# EAGLE design FIDO2AUTH_0021 (EAGLE 7.7.0)

## Sheet 1 of 4
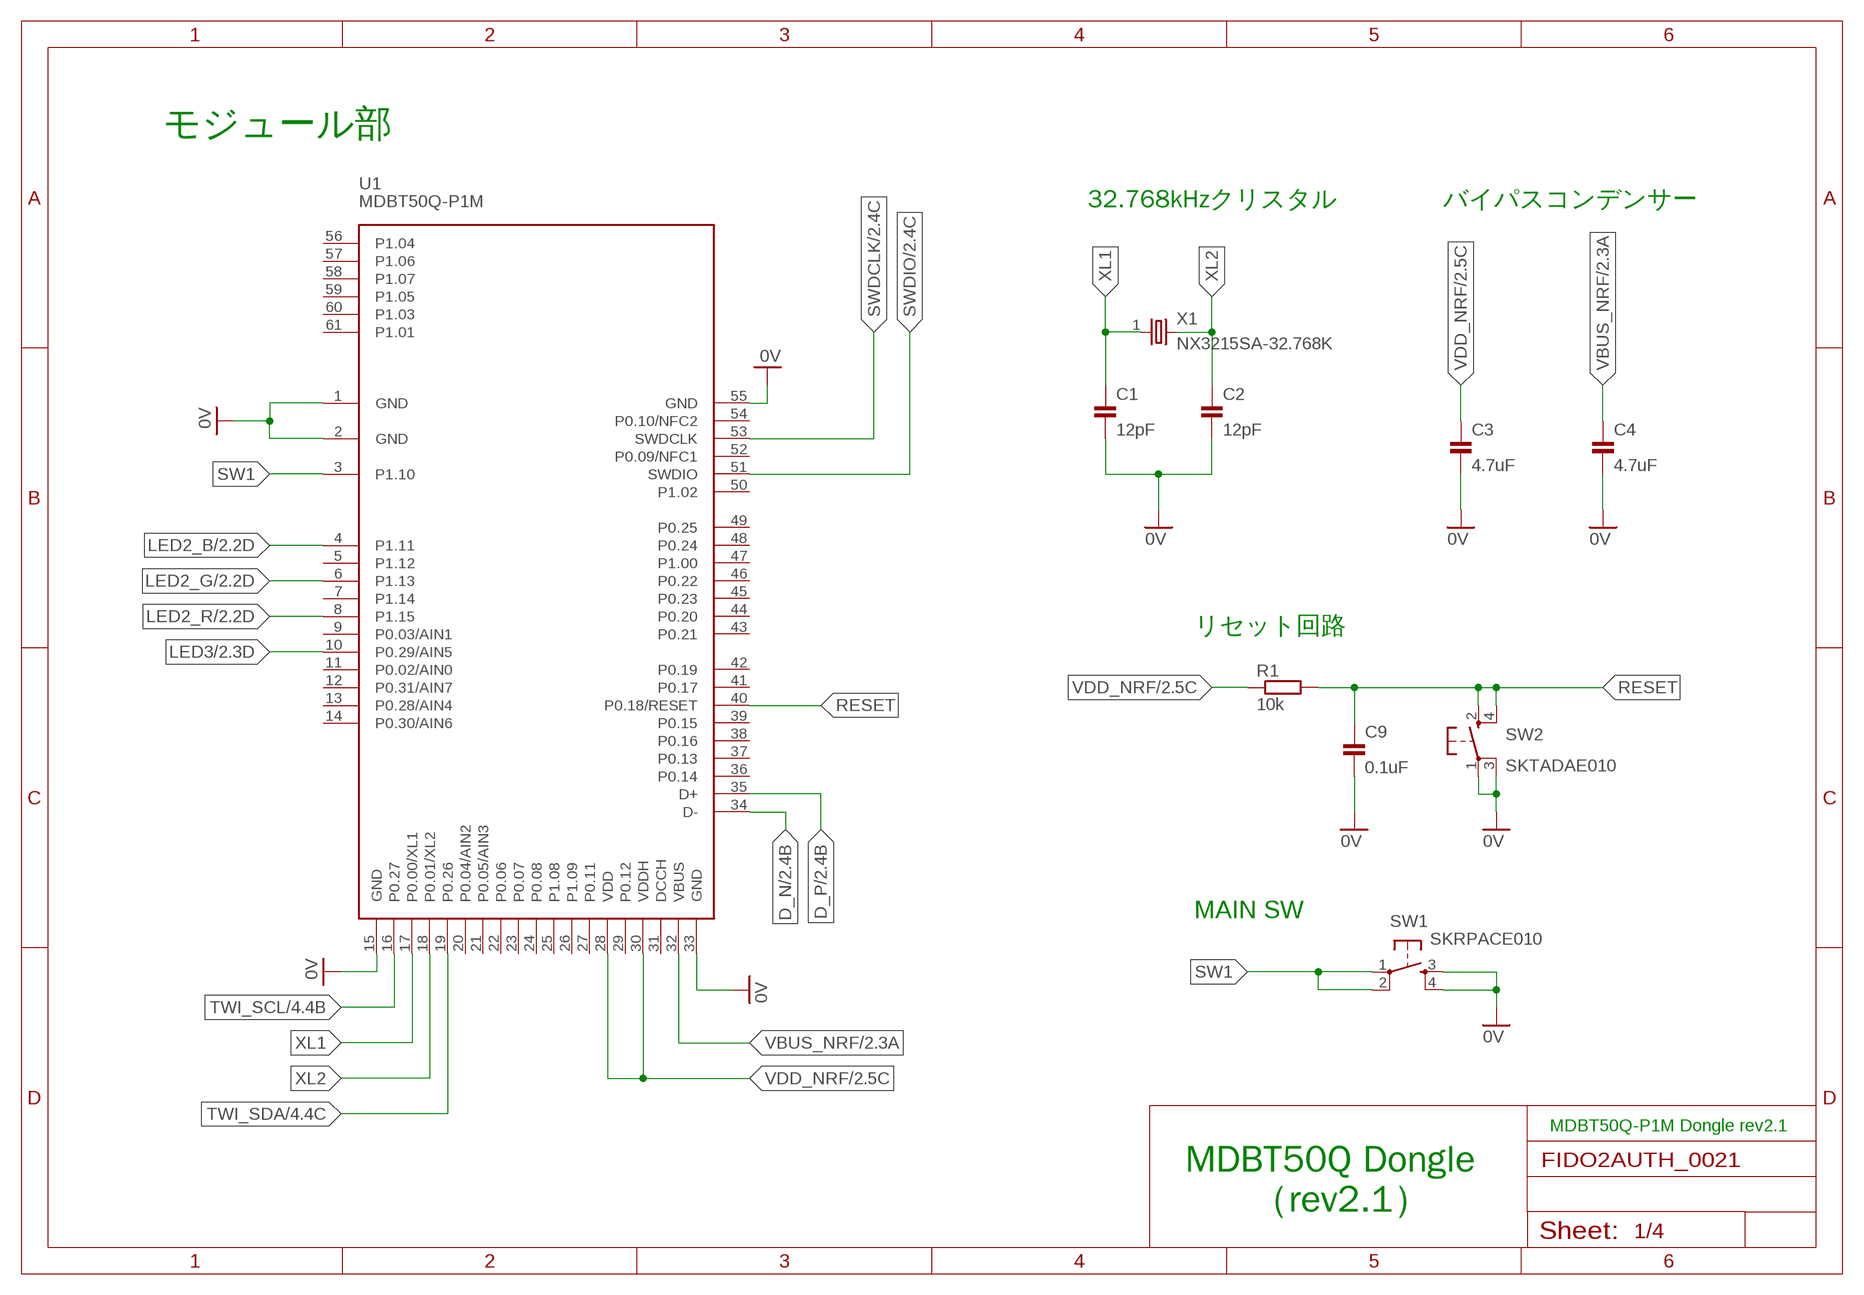
[diagram p0: schematic, sheet 1]

### Parts
C1  12pF  CAP_0603  [C0603K]
C2  12pF  CAP_0603  [C0603K]
C3  4.7uF  CAP_0603  [C0603K]
C4  4.7uF  CAP_0603  [C0603K]
C9  0.1uF  CAP_0402  [C0402K]
R1  10k  RESISTOR_0402  [R0402]
SW1  SKRPACE010  [SKRPACE010]
SW2  SKTADAE010  [SKTADAE010]
U1  MDBT50Q-P1M  [MDBT50Q-P1M]
X1  NX3215SA-32.768K  [NX3215]

### Nets
0V: C1.2 C2.2 C3.2 C4.2 C9.2 SW1.3(S) SW1.4(S1) SW2.1(P) SW2.3(P1) U1.1(GND) U1.2(GND) U1.15(GND) U1.33(GND) U1.55(GND) ; also sheet 2,3,4
D_N: U1.34(D-) ; also sheet 2
D_P: U1.35(D+) ; also sheet 2
LED2_B: U1.4(P1.11) ; also sheet 2
LED2_G: U1.6(P1.13) ; also sheet 2
LED2_R: U1.8(P1.15) ; also sheet 2
LED3: U1.10(P0.29/AIN5) ; also sheet 2
RESET: C9.1 R1.2 SW2.2(S) SW2.4(S1) U1.40(P0.18/RESET)
SW1: SW1.1(P) SW1.2(P1) U1.3(P1.10)
SWDCLK: U1.53(SWDCLK) ; also sheet 2
SWDIO: U1.51(SWDIO) ; also sheet 2
TWI_SCL: U1.16(P0.27) ; also sheet 4
TWI_SDA: U1.19(P0.26) ; also sheet 4
VBUS_NRF: C4.1 U1.32(VBUS) ; also sheet 2,3
VDD_NRF: C3.1 R1.1 U1.28(VDD) U1.30(VDDH) ; also sheet 2,3,4
XL1: C1.1 U1.17(P0.00/XL1) X1.1
XL2: C2.1 U1.18(P0.01/XL2) X1.2
Unconnected: U1.5(P1.12) U1.7(P1.14) U1.9(P0.03/AIN1) U1.11(P0.02/AIN0) U1.12(P0.31/AIN7) U1.13(P0.28/AIN4) U1.14(P0.30/AIN6) U1.20(P0.04/AIN2) U1.21(P0.05/AIN3) U1.22(P0.06) U1.23(P0.07) U1.24(P0.08) U1.25(P1.08) U1.26(P1.09) U1.27(P0.11) U1.29(P0.12) U1.31(DCCH) U1.36(P0.14) U1.37(P0.13) U1.38(P0.16) U1.39(P0.15) U1.41(P0.17) U1.42(P0.19) U1.43(P0.21) U1.44(P0.20) U1.45(P0.23) U1.46(P0.22) U1.47(P1.00) U1.48(P0.24) U1.49(P0.25) U1.50(P1.02) U1.52(P0.09/NFC1) U1.54(P0.10/NFC2) U1.56(P1.04) U1.57(P1.06) U1.58(P1.07) U1.59(P1.05) U1.60(P1.03) U1.61(P1.01)

### Notes on the sheet
- モジュール部
- 32.768kHzクリスタル | バイパスコンデンサー
- リセット回路
- MAIN SW
- MDBT50Q-P1M Dongle rev2.1
- MDBT50Q Dongle
        （rev2.1）

## Sheet 2 of 4
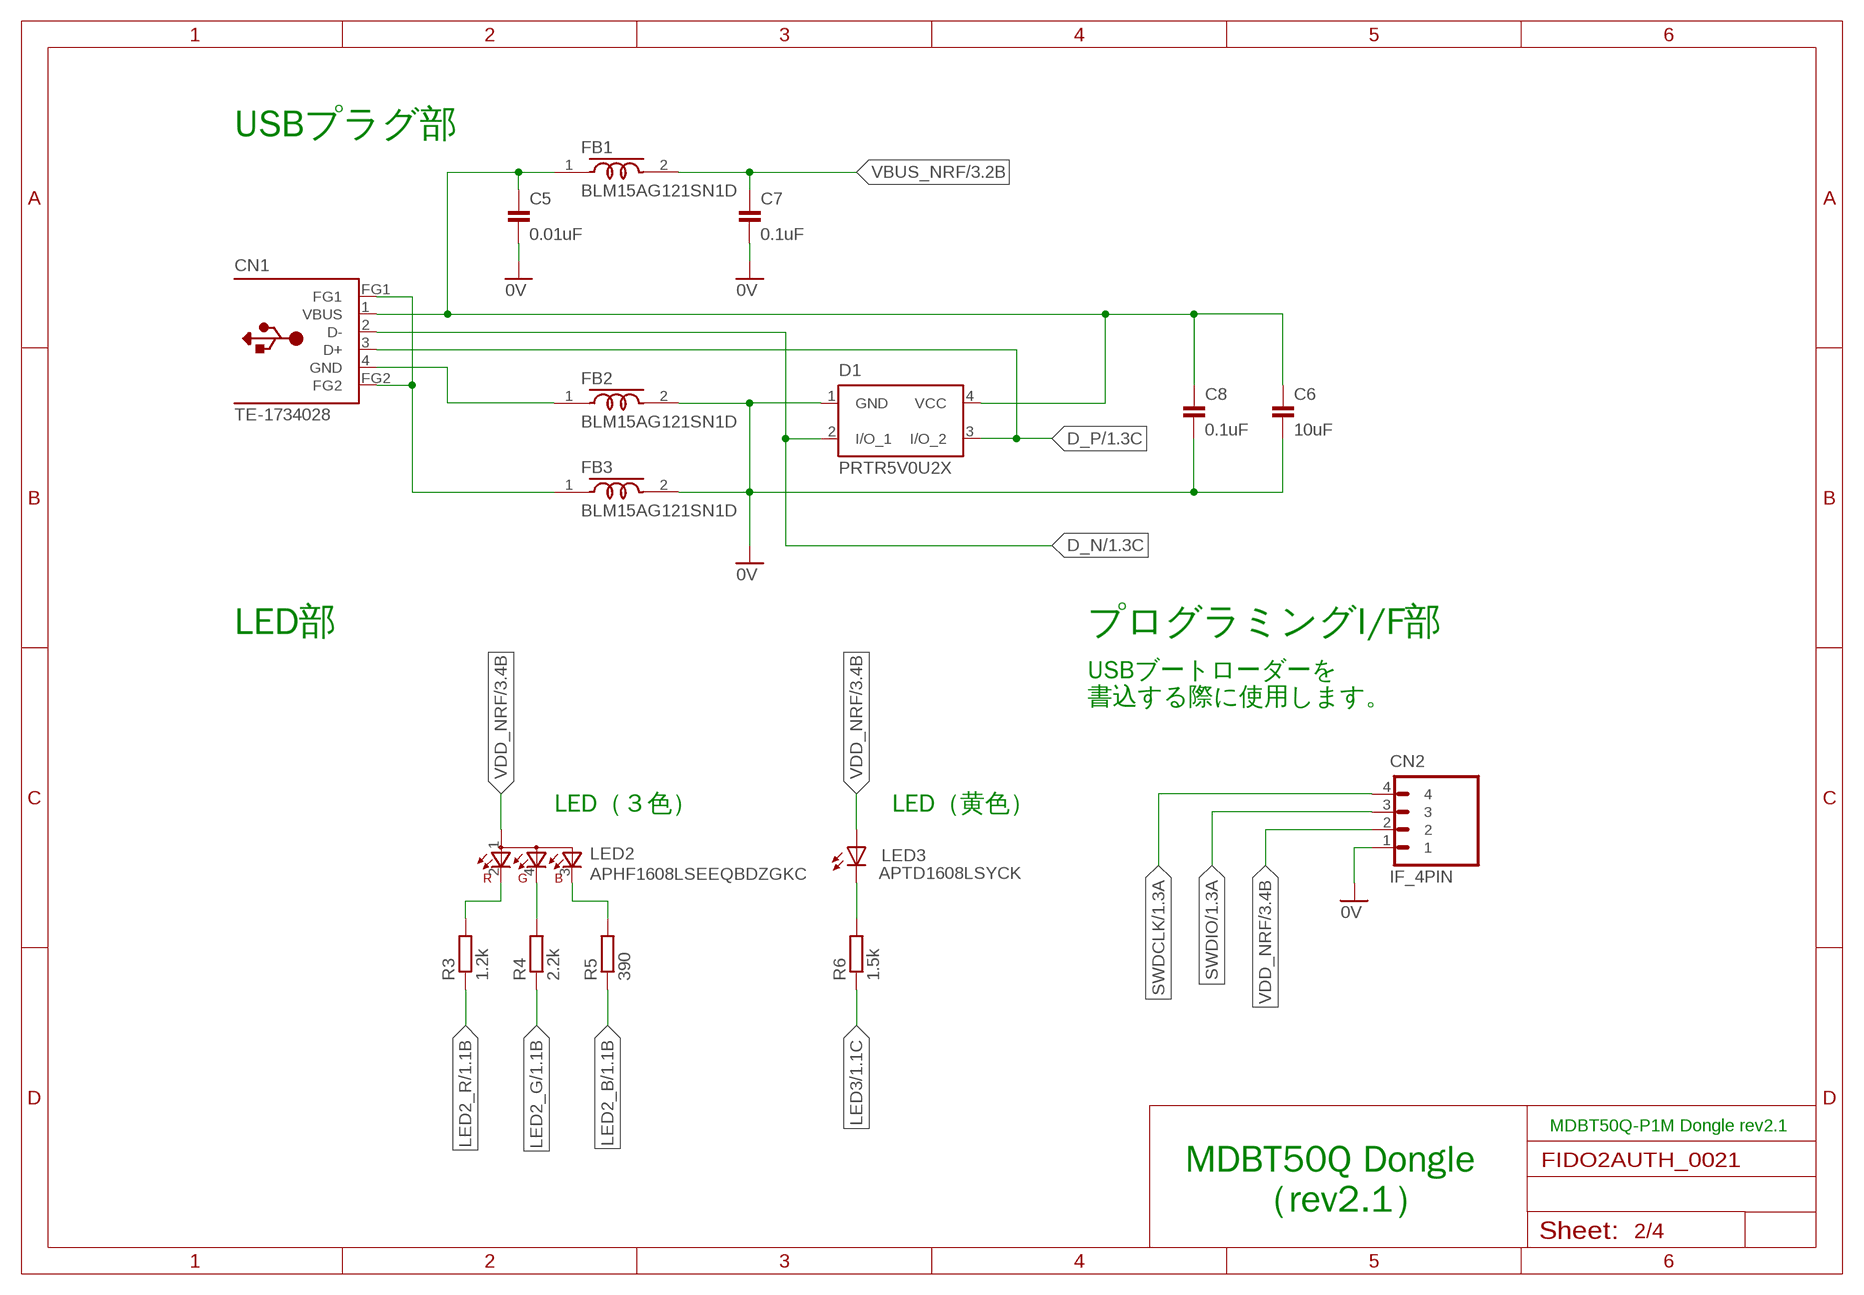
[diagram p1: schematic, sheet 2]

### Parts
C5  0.01uF  CAP_0402  [C0402K]
C6  10uF  CAP_0603  [C0603K]
C7  0.1uF  CAP_0402  [C0402K]
C8  0.1uF  CAP_0402  [C0402K]
CN1  TE-1734028  [TE-1734028]
CN2  IF_4PIN  [HEADER_4PIN]
D1  PRTR5V0U2X  [SOT143B]
FB1  BLM15AG121SN1D  [C0402K@1]
FB2  BLM15AG121SN1D  [C0402K@1]
FB3  BLM15AG121SN1D  [C0402K@1]
LED2  APHF1608LSEEQBDZGKC  [APHF1608LSEEQBDZGKC]
LED3  APTD1608LSYCK  [CHIPLED_0603]
R3  1.2k  RESISTOR_0402  [R0402]
R4  2.2k  RESISTOR_0402  [R0402]
R5  390  RESISTOR_0402  [R0402]
R6  1.5k  RESISTOR_0402  [R0402]

### Nets
0V: C5.2 C6.2 C7.2 C8.2 CN2.1 D1.1(GND) FB2.2 FB3.2 ; also sheet 1,3,4
D_N: CN1.2(D-) D1.2(I/O_1) ; also sheet 1
D_P: CN1.3(D+) D1.3(I/O_2) ; also sheet 1
LED2_B: R5.1 ; also sheet 1
LED2_G: R4.1 ; also sheet 1
LED2_R: R3.1 ; also sheet 1
LED3: R6.1 ; also sheet 1
N$1: LED2.2(CRED) R3.2
N$2: CN1.4(GND) FB2.1
N$3: CN1.FG1 CN1.FG2 FB3.1
N$6: LED2.4(CGREEN) R4.2
N$7: LED2.3(CBLUE) R5.2
N$8: LED3.C R6.2
SWDCLK: CN2.4 ; also sheet 1
SWDIO: CN2.3 ; also sheet 1
VBUS: C5.1 C6.1 C8.1 CN1.1(VBUS) D1.4(VCC) FB1.1
VBUS_NRF: C7.1 FB1.2 ; also sheet 1,3
VDD_NRF: CN2.2 LED2.1(A) LED3.A ; also sheet 1,3,4

### Notes on the sheet
- USBプラグ部
- LED部 | プログラミングI/F部
- USBブートローダーを
  書込する際に使用します。
- LED（３色） | LED（黄色）
- MDBT50Q-P1M Dongle rev2.1
- MDBT50Q Dongle
        （rev2.1）

## Sheet 3 of 4
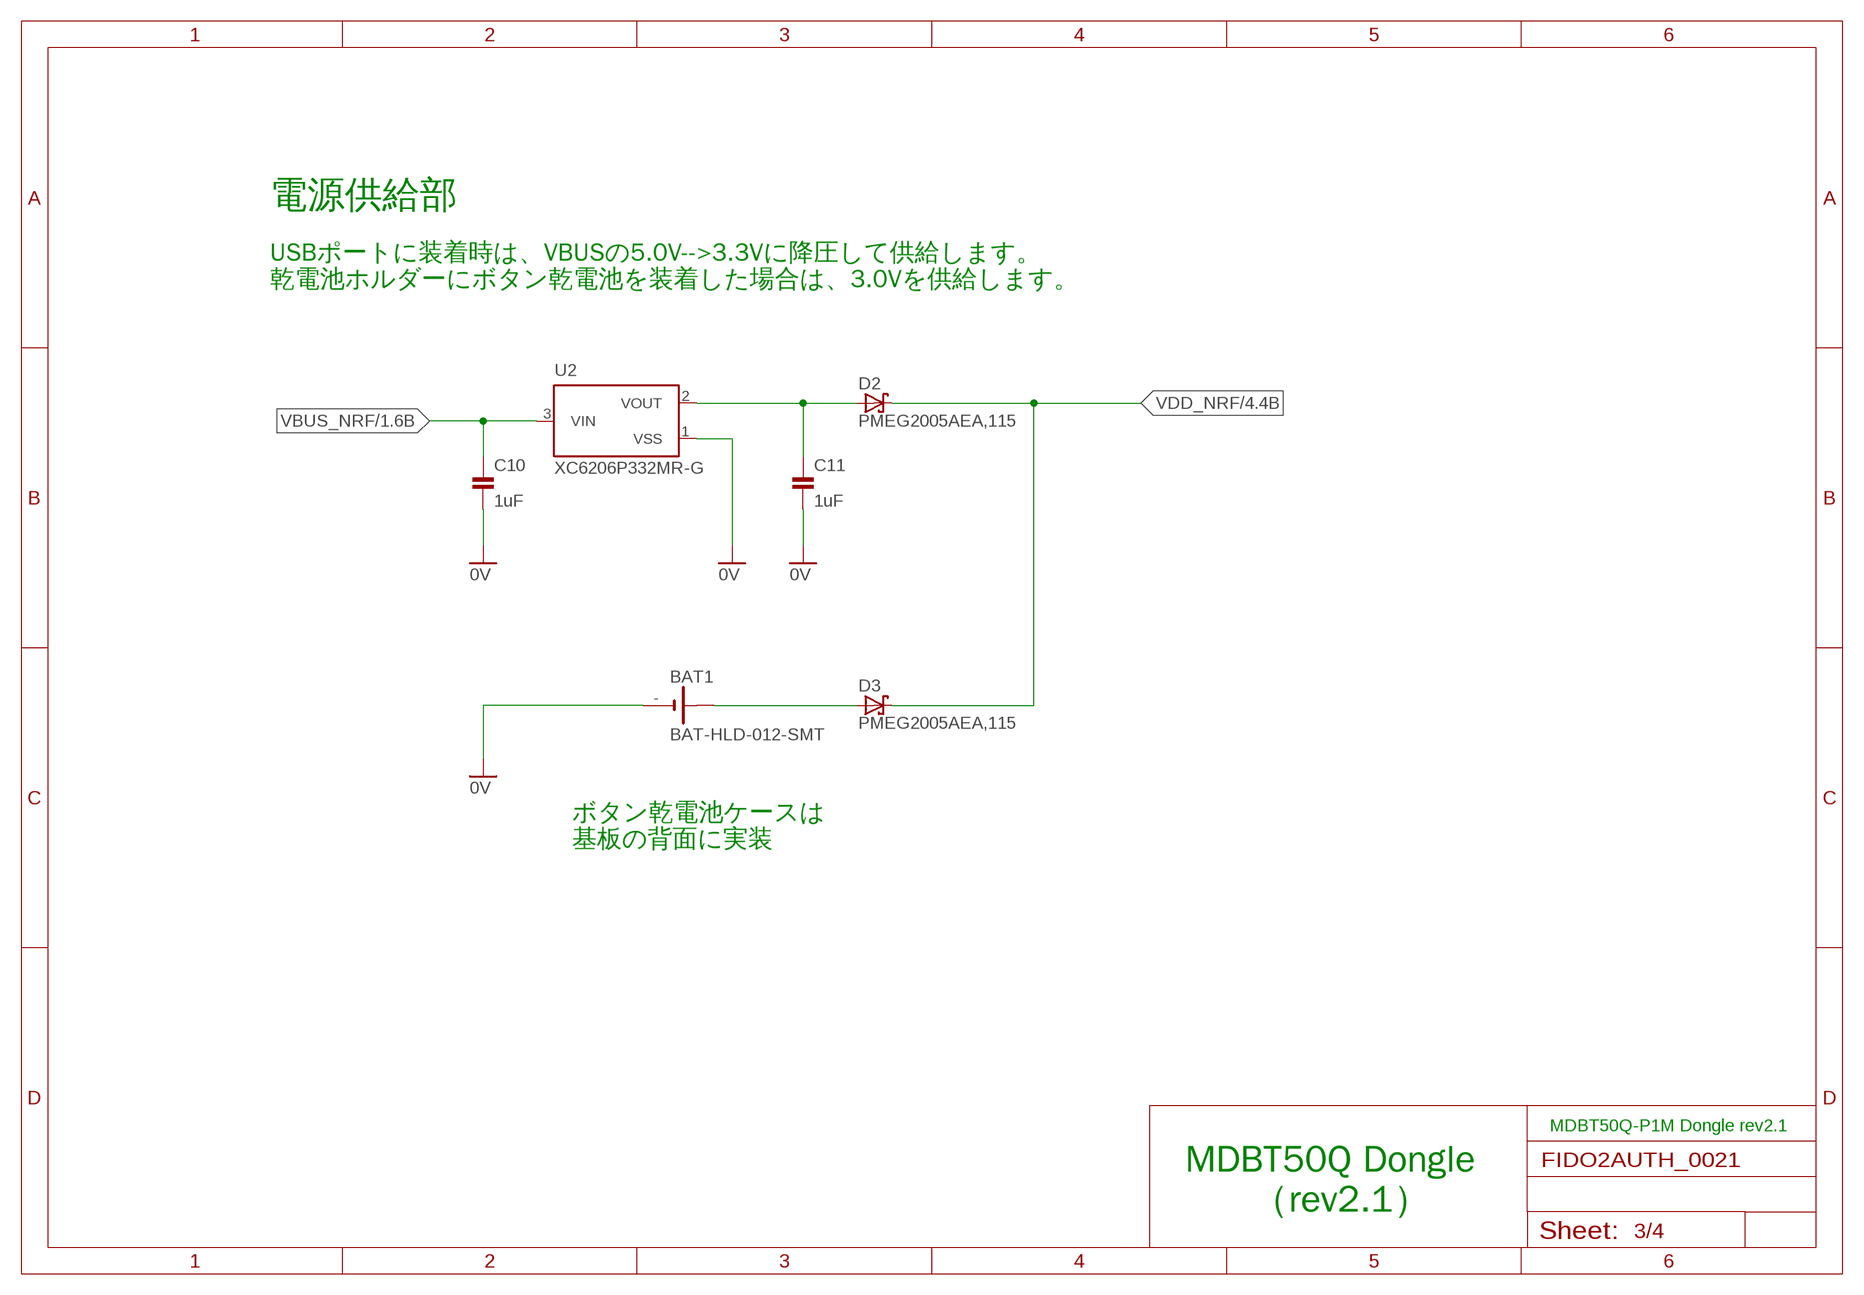
[diagram p2: schematic, sheet 3]

### Parts
BAT1  BAT-HLD-012-SMT  [BAT-HLD-012-SMT]
C10  1uF  CAP_0603  [C0603K]
C11  1uF  CAP_0603  [C0603K]
D2  PMEG2005AEA,115  [SOD323-W]
D3  PMEG2005AEA,115  [SOD323-W]
U2  XC6206P332MR-G  [SOT23]

### Nets
0V: BAT1.- C10.2 C11.2 U2.1(VSS) ; also sheet 1,2,4
N$4: C11.1 D2.A U2.2(VOUT)
N$5: BAT1.+@1(+) D3.A
VBUS_NRF: C10.1 U2.3(VIN) ; also sheet 1,2
VDD_NRF: D2.C D3.C ; also sheet 1,2,4

### Notes on the sheet
- 電源供給部
- USBポートに装着時は、VBUSの5.0V-->3.3Vに降圧して供給します。
  乾電池ホルダーにボタン乾電池を装着した場合は、3.0Vを供給します。
- ボタン乾電池ケースは
  基板の背面に実装
- MDBT50Q-P1M Dongle rev2.1
- MDBT50Q Dongle
        （rev2.1）

## Sheet 4 of 4
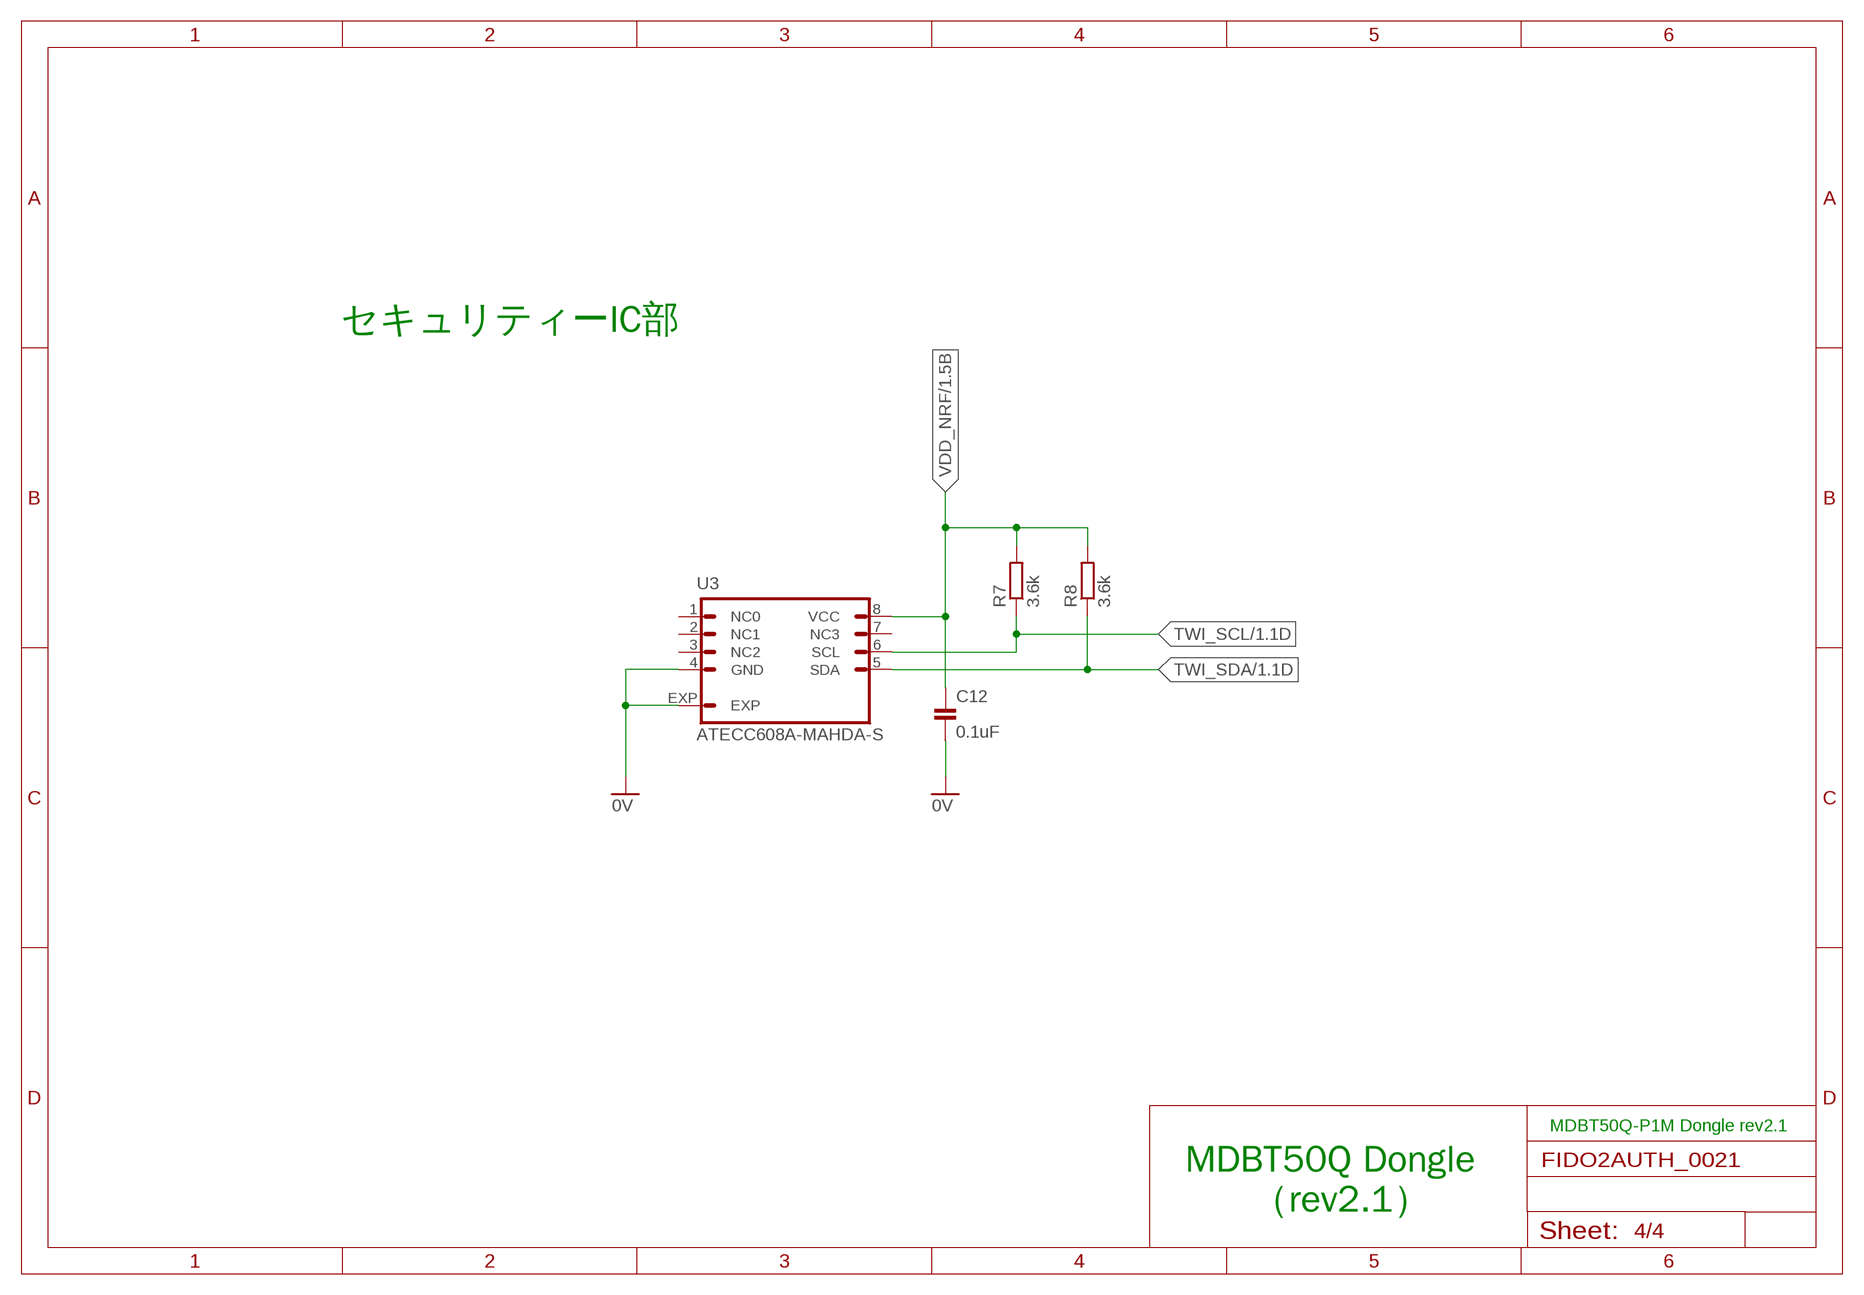
[diagram p3: schematic, sheet 4]

### Parts
C12  0.1uF  CAP_0402  [C0402K]
R7  3.6k  RESISTOR_0402  [R0402]
R8  3.6k  RESISTOR_0402  [R0402]
U3  ATECC608A-MAHDA-S  [DFN-2X3]

### Nets
0V: C12.2 U3.4(GND) U3.EXP ; also sheet 1,2,3
TWI_SCL: R7.1 U3.6(SCL) ; also sheet 1
TWI_SDA: R8.1 U3.5(SDA) ; also sheet 1
VDD_NRF: C12.1 R7.2 R8.2 U3.8(VCC) ; also sheet 1,2,3
Unconnected: U3.1(NC0) U3.2(NC1) U3.3(NC2) U3.7(NC3)

### Notes on the sheet
- セキュリティーIC部
- MDBT50Q-P1M Dongle rev2.1
- MDBT50Q Dongle
        （rev2.1）

## Library data of the parts
BAT1 = Connectors:BAT-HLD-012-SMT: ボタン電池ホルダー(CR1216/1225)
C1-C12 = Parts:CAP: コンデンサー
CN1 = Connectors:TE-1734028: USB connector plug TE Connectivity
CN2 = Connectors:IF_4PIN: 4-pin インターフェース
D1 = Parts:PRTR5V0U2X: ESD protection diode
D2 D3 = Parts:PMEG2005: ショットキーダイオード If - 順電流: 500 mA Vrrm - 繰返し逆電圧: 20 V Vf - 順電圧: 0.39 V Ifsm - 順方向サージ電流: 10 A 最低動作温度: - 65 C 最高動作温度: + 150 C
FB1-FB3 = Parts:BLM15AG: フェライトビーズ EMIFIL®
LED2 = Parts:APHF1608: Chip LED RGB Source: http://document.sharpsma.com/files/GM1WA55311A_SS.pdf
LED3 = Parts:APTD1608: 発光ダイオード
R1 R3-R8 = Parts:RESISTOR: 抵抗器
SW1 = Parts:SKRPACE010: 表面実装用タクトスイッチ ４．２×３．２ｍｍ小型重作動力タイプ ・作動力：２．５５Ｎ ・操作方向：垂直 ・移動量：０．２ｍｍ ・動作寿命：５０，０００ｃｙｃｌｅｓ （５ｍＡ ５ＶＤＣ） ・初期接触抵抗：最大５００ｍΩ
SW2 = Parts:SKTADAE010: 表面実装用タクトスイッチ 2.6×1.6ｍｍ小型重作動力タイプ ・作動力：2.4 N ・操作方向：垂直 ・移動量：0.11 mm ・定格：50 mA 12 VDC
U1 = Modules:MDBT50Q-P1M: MDBT50Q – P1M (PCB Antenna) Bluetooth 5, IEEE 802.15.4, 2.4 GHz transceiver ARM Cortex –M4 32-bit processor with FPU, 64 MHz Memory: 1MB flash / 256KB RAM ‧Supply voltage range 1.7V to 5.5V ‧On-chip DC/DC and LDO regulators with automated low current modes ‧Regulated supply for external components from 1.8V to 3.3V ‧0.4uA at 3V in System OFF mode, no RAM retention ‧1.5uA at 3V in System ON mode, no RAM retention, wake on RTC Working distance 1Mbps: up to 250 meters in open space 2Mbps: up to 120 meters in open space
U2 = Parts:XC6206: 電圧レギュレータ 出力電圧: 3.3 V 出力電流: 200 mA 入力電圧最大値: 6 V 最小入力電圧: 1.8 V 動作供給電流: 1 uA 最低動作温度: - 40 C 最高動作温度: + 85 C
U3 = ICs:ATECC608A: high-security cryptographic device 供給電圧: 2 〜 5.5 V 動作温度: - 40 C 〜 + 85 C 供給電流 - 最大: 14 mA 動作供給電流: 2 mA
X1 = Parts:NX3215SA: 水晶振動子 周波数 32.768kHz 周波数公差 ±20ppm 負荷容量 6pF ESR（等価直列抵抗） 70 kOhms 動作温度 -40°C～85°C

## Board
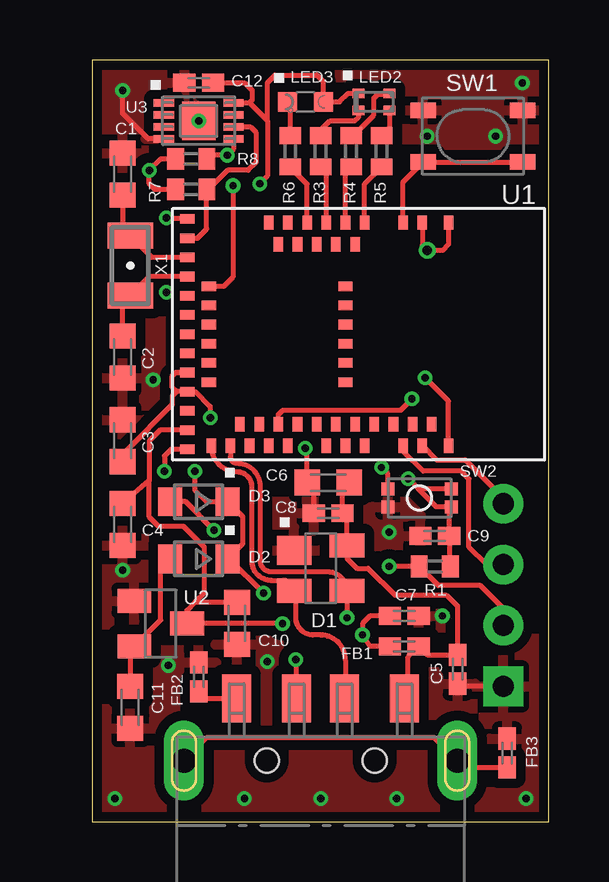
[diagram p4: board, top side]
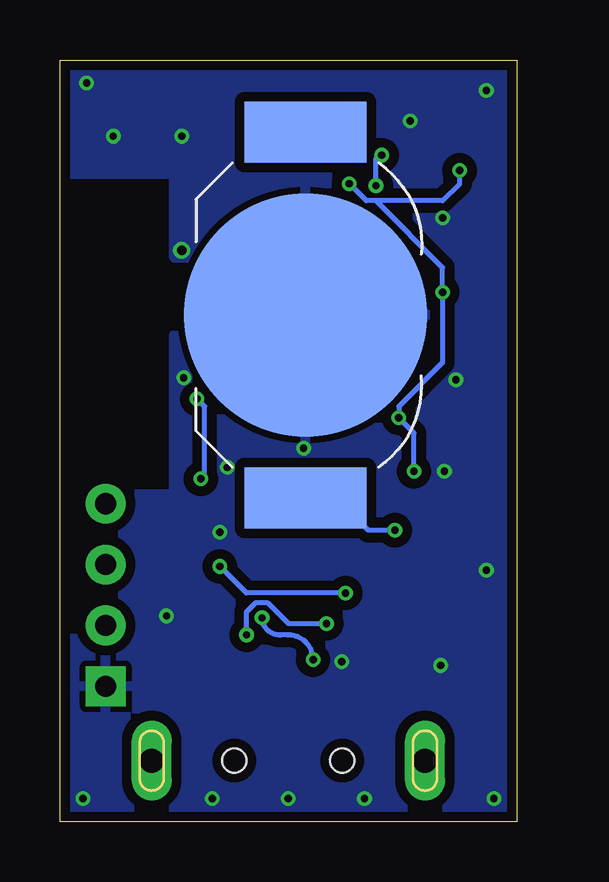
[diagram p5: board, bottom side, seen from below]

Size 19.05 x 31.75 mm. Coordinates in mm from the lower left corner, seen from the top.
Outline: 0,0 19.05,0 19.05,31.75 0,31.75 0,0
Copper layers (1*16): Top 0.035mm / dielectric 1.5mm / Bottom 0.035mm
Design rules "SeeedStudio_2layer_DRU_no_angle_20140221": minimum track width 6mil, minimum drill 12mil, track to track 6mil, track to pad 6mil, pad to pad 6mil, via to via 6mil, smd to smd 0mil, copper to edge 10mil, drill to drill 10mil, minimum pad ring 10mil, minimum via ring 6mil, stop-mask expansion 2mil, vias tented up to drill 100mil, thermal gap 10mil

### Footprints (pad centres in the part's own frame; a part is rotated, then mirrored left to right if it is on the bottom)
BAT-HLD-012-SMT = smd 2.54 x 5.08: +@1 -7.62,0; +@2 7.62,0 | smd 10.16 x 10.16: - 0,0
C0603K = smd 1.05 x 1.08: 1 -0.875,0; 2 0.875,0
C0402K = smd 0.925 x 0.74: 1 -0.6,0; 2 0.6,0
TE-1734028 = smd 1.2 x 2: 1 3.5,2.6; 2 1,2.6; 3 -1,2.6; 4 -3.5,2.6 | drill 1 pad 1.676 long: FG1 5.7,0; FG2 -5.7,0 | hole 1: -2.25,0; 2.25,0
HEADER_4PIN = drill 0.889 pad 1.651 square: 1 0,0 | drill 0.889 pad 1.651: 2 2.54,0; 3 5.08,0; 4 7.62,0
SOT143B = smd 1.2 x 1.44: 1 -0.75,-1.1 | smd 1 x 1.44: 2 0.95,-1.1; 3 0.95,1.1; 4 -0.95,1.1
SOD323-W = smd 1 x 1.2: A 1.2,0; C -1.2,0
C0402K@1 = smd 0.925 x 0.74: 1 -0.6,0; 2 0.6,0
APHF1608LSEEQBDZGKC = smd 0.5 x 0.4: 1 -0.65,0.35; 2 -0.65,-0.35; 3 0.65,-0.35; 4 0.65,0.35
CHIPLED_0603 = smd 0.8 x 0.8: A -0.75,0; C 0.75,0
R0402 = smd 0.7 x 0.9: 1 -0.65,0; 2 0.65,0
SKRPACE010 = smd 1.05 x 0.65: 1 -2.075,1.075; 2 2.075,1.075; 3 -2.075,-1.075; 4 2.075,-1.075
SKTADAE010 = smd 0.55 x 0.55: 1 -1.325,0.375; 2 1.325,0.375; 3 -1.325,-0.375; 4 1.325,-0.375
MDBT50Q-P1M = smd 0.6 x 0.4: 1 -4.65,3.75; 2 -4.65,2.65; 3 -4.65,1.85; 4 -4.65,0.25; 5 -3.75,-0.15; 6 -4.65,-0.55; 7 -3.75,-0.95; 8 -4.65,-1.35; 9 -3.75,-1.75; 10 -4.65,-2.15; 11 -3.75,-2.55; 12 -4.65,-2.95; 13 -3.75,-3.35; 14 -4.65,-3.75; 34 4.65,-6.15; 35 4.65,-5.35; 36 3.75,-4.95; 37 4.65,-4.55; 38 3.75,-4.15; 39 4.65,-3.75; 40 3.75,-3.35; 41 4.65,-2.95; 42 3.75,-2.55; 43 3.75,-1.75; 44 4.65,-1.35; 45 3.75,-0.95; 46 4.65,-0.55; 47 3.75,-0.15; 48 4.65,0.25; 49 3.75,0.65; 50 3.75,1.45; 51 4.65,1.85; 52 3.75,2.25; 53 4.65,2.65; 54 3.75,3.05; 55 4.65,3.75 | smd 0.4 x 0.6: 15 -4.8,-7.15; 16 -4,-7.15; 17 -3.2,-7.15; 18 -2.4,-7.15; 19 -2,-6.25; 20 -1.6,-7.15; 21 -1.2,-6.25; 22 -0.8,-7.15; 23 -0.4,-6.25; 24 0,-7.15; 25 0.4,-6.25; 26 0.8,-7.15; 27 1.2,-6.25; 28 1.6,-7.15; 29 2,-6.25; 30 2.4,-7.15; 31 3.2,-7.15; 32 4,-7.15; 33 4.8,-7.15; 56 -2,-0.55; 57 -1.2,-0.55; 58 -0.4,-0.55; 59 0.4,-0.55; 60 1.2,-0.55; 61 2,-0.55
SOT23 = smd 1 x 1.4: 1 -0.95,-1.1; 2 0.95,-1.1; 3 0,1.1
DFN-2X3 = smd 0.3 x 0.85: 1 -0.75,-1.45; 2 -0.25,-1.45; 3 0.25,-1.45; 4 0.75,-1.45; 5 0.75,1.45; 6 0.25,1.45; 7 -0.25,1.45; 8 -0.75,1.45 | smd 1.6 x 1.4: EXP 0,0
NX3215 = smd 1.1 x 1.9: 1 -1.25,0; 2 1.25,0

### Placement (x,y rotation side)
BAT1  8.81,21.11 90 bottom
C1  1.27,26.99 90 top
C2  1.27,19.37 270 top
C3  1.27,15.88 90 top
C4  1.27,12.38 270 top
C5  15.24,6.35 270 top
C6  9.84,14.13 180 top
C7  13.02,8.57 0 top
C8  9.84,12.86 180 top
C9  14.29,11.91 180 top
C10  6.03,8.26 270 top
C11  1.59,4.76 270 top
C12  4.45,30.8 180 top
CN1  9.53,2.54 0 top
CN2  17.14,5.64 90 top
D1  9.53,10.56 270 top
D2  4.45,10.95 180 top
D3  4.45,13.34 180 top
FB1  13.02,7.3 180 top
FB2  4.45,6.03 90 top
FB3  17.3,2.86 90 top
LED2  11.75,30 0 top
LED3  8.89,30 180 top
R1  14.29,10.64 0 top
R3  9.53,27.94 90 top
R4  10.79,27.94 90 top
R5  12.06,27.94 90 top
R6  8.26,27.94 90 top
R7  4.13,26.35 180 top
R8  4.13,27.62 180 top
SW1  15.88,28.57 180 top
SW2  13.65,13.49 0 top
U1  11.11,20.32 270 top
U2  2.86,8.26 270 top
U3  4.45,29.21 270 top
X1  1.59,23.18 270 top

### Tracks (layer width: path | path; a pad name or v marks a point on that pad's centre or on a via)
0V  (via drill 0.3, 0.4)
  Top 0.203: U1.55 14.86,17.52 v13.89,18.49 | U1.33 3.3,15.52 3.02,15.24 v3.02,14.61 | CN2.1 15.35,5.64 C5.2 | U1.2 13.76,24.02 v13.97,23.81 14.61,23.81 14.86,24.07 U1.1 | SW2.1 12.33,14.5 v12.06,14.76 | U3.4 2.34,28.46 1.27,29.53 v1.27,30.48 | v3.1,25.16 3.92,25.16 U1.15 | C8.2 9.24,13.85 C6.2 8.97,15.48 v8.89,15.56
  other vias: 17.94,30.8 12.38,12.06 4.45,29.21 14.61,8.57 3.17,6.51 1.27,10.48 7.3,6.67 2.54,18.41 0.95,0.95 6.35,0.95 9.53,0.95 12.7,0.95 18.1,0.95 16.83,28.57 13.97,28.57
  pour Bottom (isolate 0.406, rank 3): -1.11,-1.27 20.16,-1.27 20.16,13.65 14.29,13.65 14.29,20.32 13.02,20.32 13.02,23.5 14.29,23.5 14.29,26.99 20.16,26.99 20.16,32.7 -1.11,32.7
  pour Top (isolate 0.406, rank 3): -2.22,33.97 21.59,33.97 21.59,27.3 2.86,27.3 2.86,13.34 21.59,13.34 21.59,-2.54 -2.22,-2.54
D_N
  Top 0.152: D1.2 8.49,9.54
  Top 0.203: CN1.2 arc90 10.56,5.17 10.56,6.75 arc90 9.53,7.78 9.21,7.78 arc-90 8.49,8.49 8.49,9.54 | U1.34 4.96,15.66 arc90 6.03,14.59 arc-90 6.65,13.97 6.65,10.87 arc90 7.46,10.06 7.97,10.06 arc-90 D1.2
D_P  (via drill 0.3)
  Top 0.203: v8.49,6.75 8.49,5.17 arc90 CN1.3 | U1.35 5.76,15.21 arc90 6.03,14.94 arc-90 7,13.97 7,10.87 arc90 7.46,10.42 9.81,10.42 arc-90 D1.3 v10.62,8.49
  Bottom 0.203: v8.49,6.75 arc-90 9.53,7.78 9.84,7.78 arc90 v10.62,8.49
LED2_B
  Top 0.203: U1.4 11.36,26.59 R5.1
LED2_G
  Top 0.203: U1.6 10.56,27.06 R4.1
LED2_R
  Top 0.203: U1.8 9.76,27.05 R3.1
LED3
  Top 0.203: U1.10 8.96,26.58 R6.1
N$1
  Top 0.203: R3.2 9.53,28.81 9.92,29.21 10.95,29.21 11.1,29.35 LED2.2
N$2
  Top 0.203: FB2.1 4.74,5.14 CN1.4
N$3
  Top 0.203: FB3.1 15.51,2.26 CN1.FG1 14.27,3.49 4.78,3.49 CN1.FG2
N$4
  Top 0.203: C11.1 1.59,7.13 U2.2 2.86,8.4 2.86,10.57 D2.A
N$5  (via drill 0.3)
  Top 0.203: v5.08,12.14 3.89,13.34 D3.A
  Bottom 0.203: v5.08,12.14 6.19,12.14 7.46,13.41 8.73,13.41 BAT1.+@1
N$6
  Top 0.203: R4.2 10.89,28.59 11.75,29.45 11.75,30.16 11.91,30.32 12.37,30.32 LED2.4
N$7
  Top 0.203: LED2.3 12.4,28.92 R5.2
N$8
  Top 0.203: LED3.C 8.26,30.05 R6.2
RESET  (via drill 0.3)
  Top 0.203: v13.34,17.62 12.86,17.14 7.94,17.14 7.76,16.97 U1.40 | R1.2 14.89,10.69 C9.1 14.89,13.03 SW2.4 14.35,13.12 13.6,13.87 | SW2.2 13.6,13.87 | 13.6,13.87 v13.18,14.29
  Bottom 0.203: v13.18,14.29 13.02,14.45 13.02,17.3 v13.34,17.62
SW1
  Top 0.203: U1.3 12.96,26.66 SW1.2 SW1.1
SWDCLK
  Top 0.203: CN2.4 17.14,13.49 15.56,15.08 14.35,15.08 U1.53
SWDIO
  Top 0.203: CN2.3 16.43,10.72 15.72,11.43 15.72,14.29 15.4,14.61 13.81,14.61 12.96,15.45 U1.51
TWI_SCL
  Top 0.203: U1.16 4.4,24.32 4.78,24.7 R7.1 4.84,26.35 5.64,27.15 6.51,27.15 6.83,27.46 6.83,28.73 6.6,28.96 U3.6
TWI_SDA  (via drill 0.3)
  Top 0.203: U1.19 5.49,22.32 5.87,22.7 v5.87,26.51 | U3.5 5.89,28.04 v5.64,27.78 4.94,27.78 R8.1
  Bottom 0.203: v5.87,26.51 5.87,27.62 v5.64,27.78
VBUS
  Top 0.203: CN1.1 13.18,5.29 13.18,6.86 FB1.1 13.97,6.95 C5.1 15.24,8.97 14.76,9.45 12.62,9.45 11.51,10.56 11.03,10.56 10.62,10.96 D1.4 10.62,12.68 C8.1 10.44,13.85 C6.1
VBUS_NRF  (via drill 0.3)
  Top 0.203: C10.1 4.28,9.13 | U1.32 2.83,16.32 2.38,15.88 2.38,14.21 | 2.38,14.21 C4.1 | 4.28,9.13 3.96,8.81 U2.3 v7.94,8.26 | 4.28,9.13 4.68,9.54 4.68,11.43 3.81,12.3 2.78,12.3 2.38,12.7 2.38,14.21 | C7.1 11.59,8.57 11.27,8.26 v11.27,7.78 11.59,7.3 FB1.2
  Bottom 0.203: v11.27,7.78 11.27,8.73 10.87,9.13 10.4,9.13 9.53,8.26 v7.94,8.26
VDD_NRF  (via drill 0.3)
  Top 0.203: CN2.2 17.14,8.89 16.19,9.84 14.43,9.84 R1.1 v12.38,10.64 | v4.29,14.61 4.29,13.81 4.76,13.34 D3.C 6.27,12.71 6.27,11.58 D2.C 5.71,10.95 v7.14,9.53 | C3.1 1.43,15.48 3.33,17.38 3.33,17.74 3.51,17.92 | 3.51,17.92 U1.30 4.3,17.92 4.92,17.3 v4.92,16.83 | 3.56,18.72 U1.28 3.48,18.72 3.33,18.57 3.33,18.1 3.51,17.92 | 7.3,29.21 7.3,30.8 7.62,31.11 9.37,31.11 9.64,30.84 LED3.A 10.32,30 10.67,30.35 LED2.1 | R8.2 2.86,27.62 v2.38,27.15 2.38,26.59 2.62,26.35 R7.2 | U3.8 6.55,29.96 | 6.55,29.96 7.3,29.21 | C12.1 6.35,30.8 6.67,30.48 6.67,30.07 6.55,29.96 | 7.3,29.21 7.3,26.91 v6.99,26.59
  Bottom 0.203: v12.38,10.64 11.27,9.53 v7.14,9.53 | 5.79,25.88 3.1,25.88 2.38,26.59 v2.38,27.15 | 5.79,25.88 6.27,25.88 v6.99,26.59 | v4.29,14.61 4.29,16.19 v4.92,16.83 4.92,17.3 3.1,19.13 v3.1,22.07 3.1,23.1 5.79,25.8 5.79,25.88
XL1
  Top 0.203: U1.17 2.5,23.52 X1.1 1.27,24.75 C1.1
XL2
  Top 0.203: U1.18 2.38,22.72 X1.2 1.27,21.61 C2.1